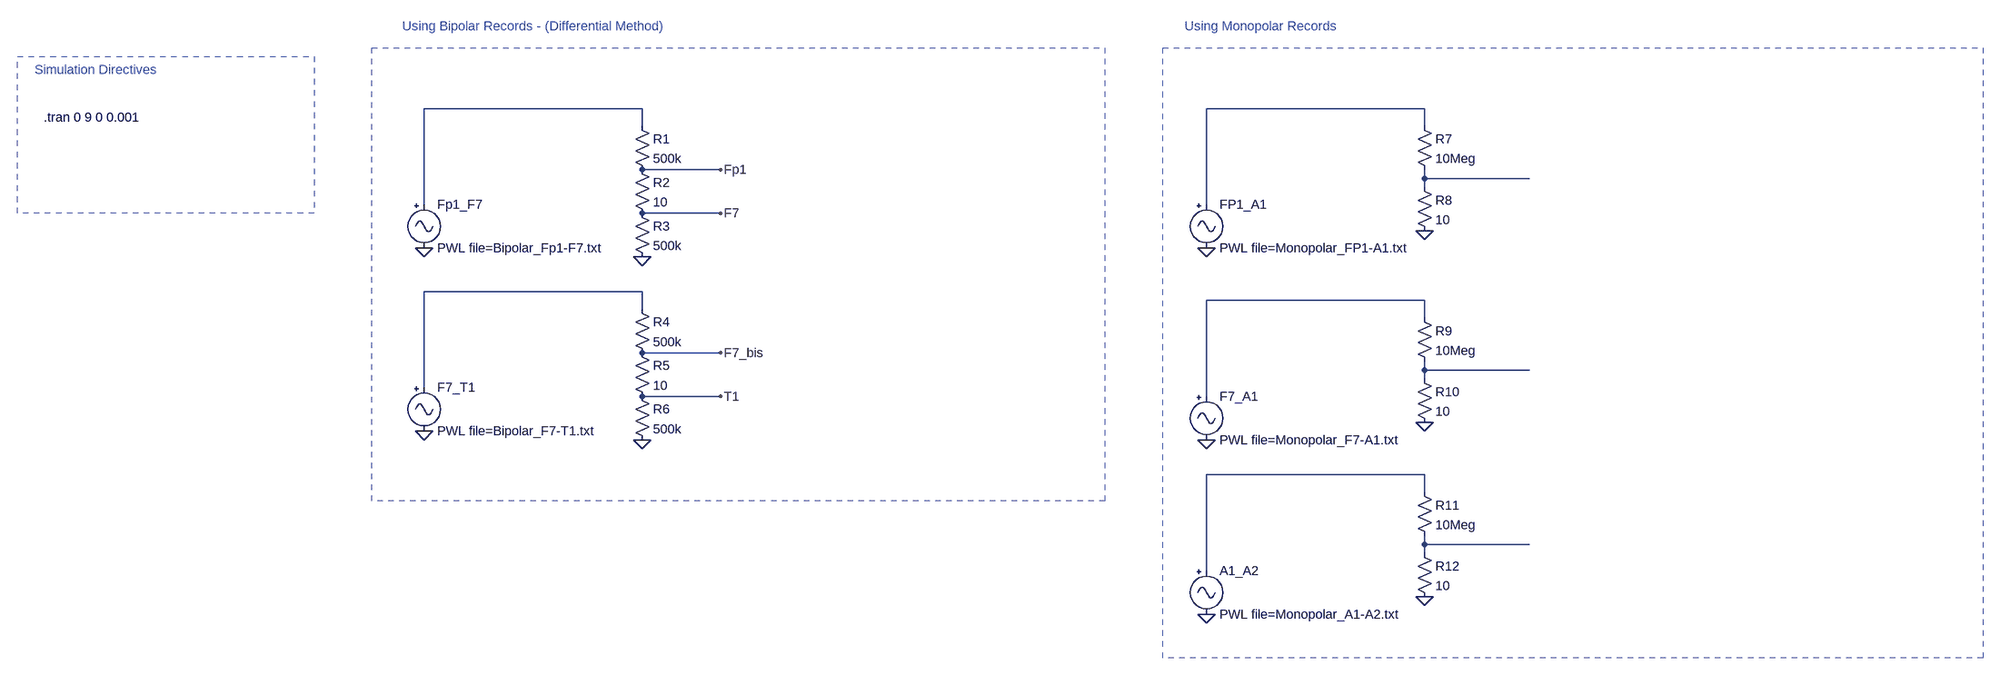
[diagram p0: schematic Test interface Out-EEG.asc]
Test interface Out-EEG.asc, the LTspice schematic file:
Version 4
SHEET 1 2340 804
WIRE -128 -208 -528 -208
WIRE 1312 -208 912 -208
WIRE -128 -176 -128 -208
WIRE 1312 -176 1312 -208
WIRE 16 -96 -128 -96
WIRE 1312 -80 1312 -96
WIRE 1504 -80 1312 -80
WIRE 1312 -64 1312 -80
WIRE -528 -32 -528 -208
WIRE 912 -32 912 -208
WIRE 16 -16 -128 -16
WIRE -128 128 -528 128
WIRE 1312 144 912 144
WIRE -128 160 -128 128
WIRE 1312 176 1312 144
WIRE 16 240 -128 240
WIRE 1312 272 1312 256
WIRE 1504 272 1312 272
WIRE 1312 288 1312 272
WIRE -528 304 -528 128
WIRE 16 320 -128 320
WIRE 912 320 912 144
WIRE 1312 464 912 464
WIRE 1312 496 1312 464
WIRE 1312 592 1312 576
WIRE 1504 592 1312 592
WIRE 1312 608 1312 592
WIRE 912 640 912 464
FLAG -528 48 0
FLAG -128 64 0
FLAG -528 384 0
FLAG -128 400 0
FLAG 16 -96 Fp1
FLAG 16 -16 F7
FLAG 16 240 F7_bis
FLAG 16 320 T1
FLAG 912 48 0
FLAG 1312 16 0
FLAG 912 400 0
FLAG 1312 368 0
FLAG 912 720 0
FLAG 1312 688 0
SYMBOL Misc\\signal -528 -48 R0
WINDOW 123 0 0 Left 0
WINDOW 39 0 0 Left 0
WINDOW 3 24 96 Left 2
SYMATTR InstName Fp1_F7
SYMATTR Value PWL file=Bipolar_Fp1-F7.txt
SYMBOL res -144 -192 R0
SYMATTR InstName R1
SYMATTR Value 500k
SYMBOL res -144 -112 R0
SYMATTR InstName R2
SYMATTR Value 10
SYMBOL res -144 -32 R0
SYMATTR InstName R3
SYMATTR Value 500k
SYMBOL Misc\\signal -528 288 R0
WINDOW 123 0 0 Left 0
WINDOW 39 0 0 Left 0
WINDOW 3 24 96 Left 2
SYMATTR InstName F7_T1
SYMATTR Value PWL file=Bipolar_F7-T1.txt
SYMBOL res -144 144 R0
SYMATTR InstName R4
SYMATTR Value 500k
SYMBOL res -144 224 R0
SYMATTR InstName R5
SYMATTR Value 10
SYMBOL res -144 304 R0
SYMATTR InstName R6
SYMATTR Value 500k
SYMBOL Misc\\signal 912 -48 R0
WINDOW 123 0 0 Left 0
WINDOW 39 0 0 Left 0
WINDOW 3 24 96 Left 2
SYMATTR InstName FP1_A1
SYMATTR Value PWL file=Monopolar_FP1-A1.txt
SYMBOL res 1296 -192 R0
SYMATTR InstName R7
SYMATTR Value 10Meg
SYMBOL res 1296 -80 R0
SYMATTR InstName R8
SYMATTR Value 10
SYMBOL Misc\\signal 912 304 R0
WINDOW 123 0 0 Left 0
WINDOW 39 0 0 Left 0
WINDOW 3 24 96 Left 2
SYMATTR InstName F7_A1
SYMATTR Value PWL file=Monopolar_F7-A1.txt
SYMBOL res 1296 160 R0
SYMATTR InstName R9
SYMATTR Value 10Meg
SYMBOL res 1296 272 R0
SYMATTR InstName R10
SYMATTR Value 10
SYMBOL Misc\\signal 912 624 R0
WINDOW 123 0 0 Left 0
WINDOW 39 0 0 Left 0
WINDOW 3 24 96 Left 2
SYMATTR InstName A1_A2
SYMATTR Value PWL file=Monopolar_A1-A2.txt
SYMBOL res 1296 480 R0
SYMATTR InstName R11
SYMATTR Value 10Meg
SYMBOL res 1296 592 R0
SYMATTR InstName R12
SYMATTR Value 10
TEXT -1296 -192 Left 2 !.tran 0 9 0 0.001
TEXT -568 -360 Left 2 ;Using Bipolar Records - (Differential Method)
TEXT -1312 -280 Left 2 ;Simulation Directives
TEXT 872 -360 Left 2 ;Using Monopolar Records
RECTANGLE Normal -800 -16 -1344 -304 1
RECTANGLE Normal 720 512 -624 -320 4
RECTANGLE Normal 2336 800 832 -320 2

The netlist it stands for:
* Test interface Out-EEG.asc
V§Fp1_F7 N001 0 PWL file=Bipolar_Fp1-F7.txt
R1 N001 Fp1 500k
R2 Fp1 F7 10
R3 F7 0 500k
V§F7_T1 N004 0 PWL file=Bipolar_F7-T1.txt
R4 N004 F7_bis 500k
R5 F7_bis T1 10
R6 T1 0 500k
V§FP1_A1 N002 0 PWL file=Monopolar_FP1-A1.txt
R7 N002 N003 10Meg
R8 N003 0 10
V§F7_A1 N005 0 PWL file=Monopolar_F7-A1.txt
R9 N005 N006 10Meg
R10 N006 0 10
V§A1_A2 N007 0 PWL file=Monopolar_A1-A2.txt
R11 N007 N008 10Meg
R12 N008 0 10
.tran 0 9 0 0.001
* Using Bipolar Records - (Differential Method)
* Simulation Directives
* Using Monopolar Records
.backanno
.end

* Results of the author's LTspice run, read from the files saved beside the schematic
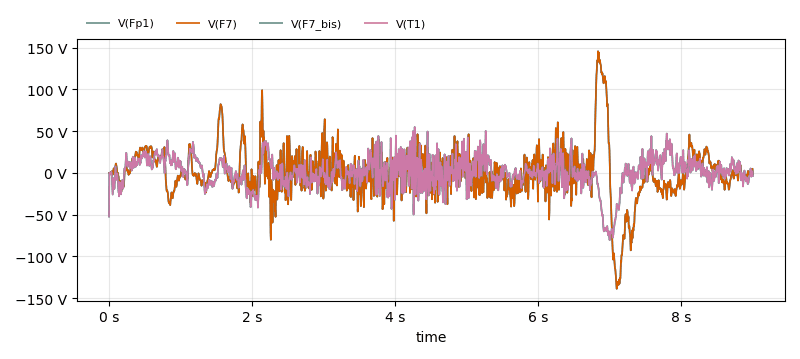
[diagram p1: Transient Analysis of Test interface Out-EEG.asc, plotted from the saved traces]
* Transient Analysis, 1 run:
*   V(Fp1): min -138.8 V, max 145.8 V, average 239.5 mV, rms 30.81 V, last -2.051 V
*   V(F7): min -138.8 V, max 145.8 V, average 239.4 mV, rms 30.81 V, last -2.051 V
*   V(F7_bis): min -80.39 V, max 54.99 V, average 427.1 mV, rms 17.68 V, last -3.614 V
*   V(T1): min -80.39 V, max 54.99 V, average 427.1 mV, rms 17.68 V, last -3.614 V